# EAGLE design differential_output_board (EAGLE 9.2.1)
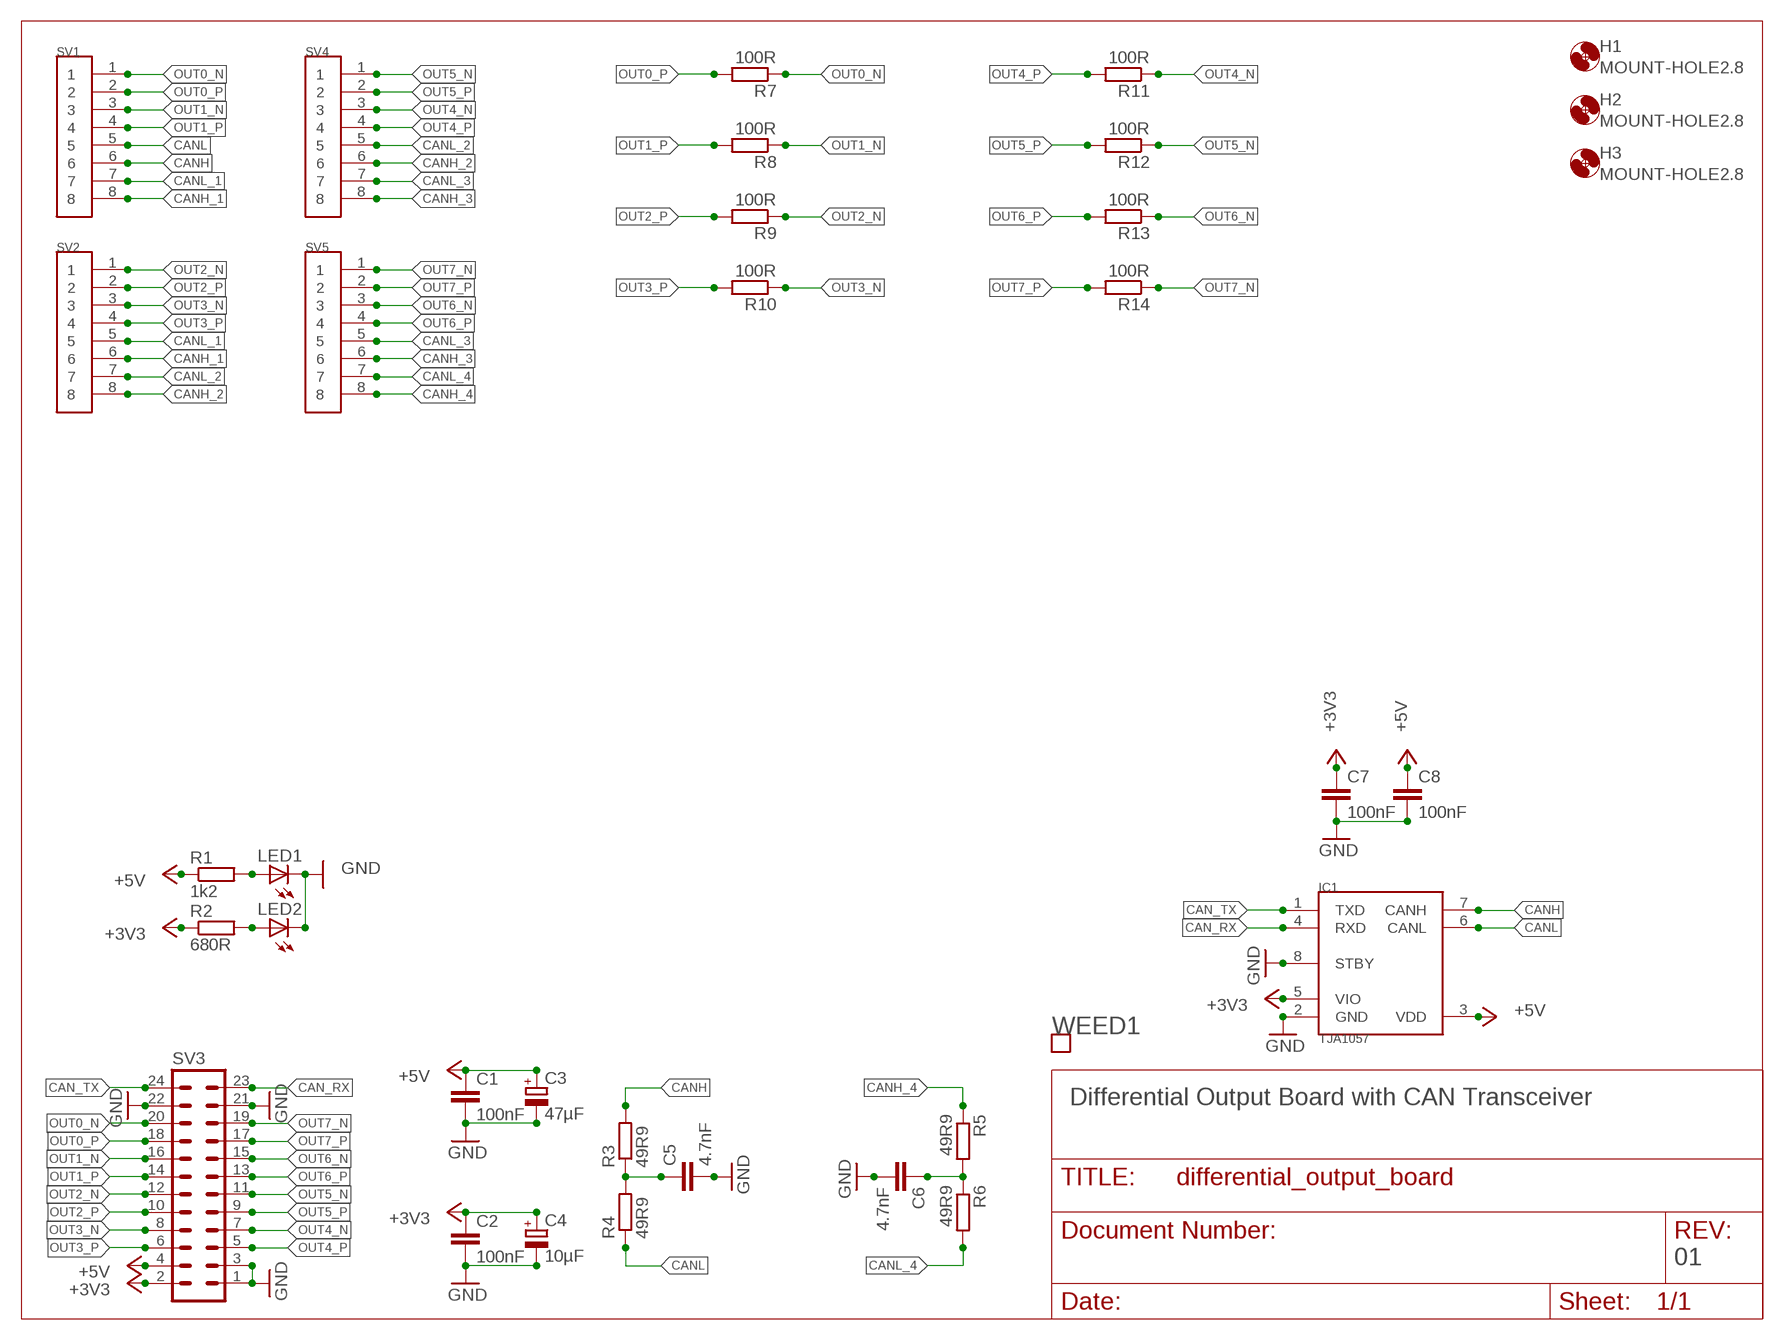
[diagram p0: schematic, sheet 1]

## Parts
C1  100nF  C-EUC0805  [C0805]
C2  100nF  C-EUC0805  [C0805]
C3  47µF  CPOL-EUSMCD  [SMC_D]
C4  10µF  CPOL-EUSMCB  [SMC_B]
C5  4.7nF  C-EUC0805  [C0805]
C6  4.7nF  C-EUC0805  [C0805]
C7  100nF  C-EUC0805  [C0805]
C8  100nF  C-EUC0805  [C0805]
H1  MOUNT-HOLE2.8  [2,8]
H2  MOUNT-HOLE2.8  [2,8]
H3  MOUNT-HOLE2.8  [2,8]
IC1  TJA1057  [SOIC8]
LED1  LEDCHIPLED_1206  [CHIPLED_1206]
LED2  LEDCHIPLED_1206  [CHIPLED_1206]
R1  1k2  R-EU_M0805  [M0805]
R2  680R  R-EU_M0805  [M0805]
R3  49R9  R-EU_M1206  [M1206]
R4  49R9  R-EU_M1206  [M1206]
R5  49R9  R-EU_M1206  [M1206]
R6  49R9  R-EU_M1206  [M1206]
R7  100R  R-EU_M1206  [M1206]
R8  100R  R-EU_M1206  [M1206]
R9  100R  R-EU_M1206  [M1206]
R10  100R  R-EU_M1206  [M1206]
R11  100R  R-EU_M1206  [M1206]
R12  100R  R-EU_M1206  [M1206]
R13  100R  R-EU_M1206  [M1206]
R14  100R  R-EU_M1206  [M1206]
SV1  SS-51000-003  [SS-51000-003]
SV2  SS-51000-003  [SS-51000-003]
SV3  MA12-2  [MA12-2]
SV4  SS-51000-003  [SS-51000-003]
SV5  SS-51000-003  [SS-51000-003]
WEED1  WEED  [DOINK]

## Nets
+3V3: C2.1 C4.+ C7.1 IC1.5(VIO) R2.1 SV3.2
+5V: C1.1 C3.+ C8.1 IC1.3(VDD) R1.1 SV3.4
CAN_RX: IC1.4(RXD) SV3.23
CAN_TX: IC1.1(TXD) SV3.24
CANH: IC1.7(CANH) R3.2 SV1.6
CANH_1: SV1.8 SV2.6
CANH_2: SV2.8 SV4.6
CANH_3: SV4.8 SV5.6
CANH_4: R5.1 SV5.8
CANL: IC1.6(CANL) R4.1 SV1.5
CANL_1: SV1.7 SV2.5
CANL_2: SV2.7 SV4.5
CANL_3: SV4.7 SV5.5
CANL_4: R6.2 SV5.7
GND: C1.2 C2.2 C3.- C4.- C5.2 C6.2 C7.2 C8.2 IC1.2(GND) IC1.8(STBY) LED1.C LED2.C SV3.1 SV3.3 SV3.21 SV3.22
N$1: C5.1 R3.1 R4.2
N$2: C6.1 R5.2 R6.1
N$13: LED1.A R1.2
N$14: LED2.A R2.2
OUT0_N: R7.1 SV1.1 SV3.20
OUT0_P: R7.2 SV1.2 SV3.18
OUT1_N: R8.1 SV1.3 SV3.16
OUT1_P: R8.2 SV1.4 SV3.14
OUT2_N: R9.1 SV2.1 SV3.12
OUT2_P: R9.2 SV2.2 SV3.10
OUT3_N: R10.1 SV2.3 SV3.8
OUT3_P: R10.2 SV2.4 SV3.6
OUT4_N: R11.1 SV3.7 SV4.3
OUT4_P: R11.2 SV3.5 SV4.4
OUT5_N: R12.1 SV3.11 SV4.1
OUT5_P: R12.2 SV3.9 SV4.2
OUT6_N: R13.1 SV3.15 SV5.3
OUT6_P: R13.2 SV3.13 SV5.4
OUT7_N: R14.1 SV3.19 SV5.1
OUT7_P: R14.2 SV3.17 SV5.2

## Notes on the sheet
- Differential Output Board with CAN Transceiver
- 01

## Library data of the parts
C1 C2 C7 C8 = rcl:C-EU: CAPACITOR, European symbol; MOUSER: 710-885012207072; SPICEPREFIX: C
C3 = rcl:CPOL-EU: POLARIZED CAPACITOR, European symbol; MOUSER: 581-TAJD476M016RNJV; SPICEPREFIX: C
C4 = rcl:CPOL-EU: POLARIZED CAPACITOR, European symbol; MOUSER: 581-TAJB106K020RNJV; SPICEPREFIX: C
C5 C6 = rcl:C-EU: CAPACITOR, European symbol; MOUSER: 710-885012207037; SPICEPREFIX: C
H1-H3 = holes:MOUNT-HOLE: MOUNTING HOLE with drill center marker
IC1 = lichtenstein_onion:TJA1057: TJA1057 – High-speed CAN transceiver Datasheet <https://www.nxp.com/docs/en/data-sheet/TJA1057.pdf>; MOUSER: 771-TJA1057GT/3J
LED1 LED2 = led:LED: LED OSRAM: - CHIPLED LG R971, LG N971, LY N971, LG Q971, LY Q971, LO R971, LY R971 LH N974, LH R974 LS Q976, LO Q976, LY Q976 LO Q996 - Hyper CHIPLED LW Q18S LB Q993, LB Q99A, LB R99A - SideLED LS A670, LO A670, LY A670, LG A670, LP A670 LB A673, LV A673, LT A673, LW A673 LH A674 LY A675 LS A676, LA A676, LO A676, LY A676, LW A676 LS A679, LY A679, LG A679 - Hyper Micro SIDELED® LS Y876, LA Y876, LO Y876, LY Y876 LT Y87S - SmartLED LW L88C, LW L88S LB L89C, LB L89S, LG L890 LS L89K, LO L89K, LY L89K LS L896, LA L896, LO L896, LY L896 - TOPLED LS T670, LO T670, LY T670, LG T670, LP T670 LSG T670, LSP T670, LSY T670, LOP T670, LYG T670 LG T671, LOG T671, LSG T671 LB T673, LV T673, LT T673, LW T673 LH T674 LS T676, LA T676, LO T676, LY T676, LB T676, LH T676, LSB T676, LW T676 LB T67C, LV T67C, LT T67C, LS T67K, LO T67K, LY T67K, LW E67C LS E67B, LA E67B, LO E67B, LY E67B, LB E67C, LV E67C, LT E67C LW T67C LS T679, LY T679, LG T679 LS T770, LO T770, LY T770, LG T770, LP T770 LB T773, LV T773, LT T773, LW T773 LH T774 LS E675, LA E675, LY E675, LS T675 LS T776, LA T776, LO T776, LY T776, LB T776 LHGB T686 LT T68C, LB T68C - Hyper Mini TOPLED® LB M676 - Mini TOPLED Santana® LG M470 LS M47K, LO M47K, LY M47K Source: http://www.osram.convergy.de LUXEON: - LUMILED® LXK2-PW12-R00, LXK2-PW12-S00, LXK2-PW14-U00, LXK2-PW14-V00 LXK2-PM12-R00, LXK2-PM12-S00, LXK2-PM14-U00 LXK2-PE12-Q00, LXK2-PE12-R00, LXK2-PE12-S00, LXK2-PE14-T00, LXK2-PE14-U00 LXK2-PB12-K00, LXK2-PB12-L00, LXK2-PB12-M00, LXK2-PB14-N00, LXK2-PB14-P00, LXK2-PB14-Q00 LXK2-PR12-L00, LXK2-PR12-M00, LXK2-PR14-Q00, LXK2-PR14-R00 LXK2-PD12-Q00, LXK2-PD12-R00, LXK2-PD12-S00 LXK2-PH12-R00, LXK2-PH12-S00 LXK2-PL12-P00, LXK2-PL12-Q00, LXK2-PL12-R00 Source: www.luxeon.com KINGBRIGHT: KA-3528ASYC Source: www.kingbright.com; MOUSER: 604-APTR3216SGC
R1 = rcl:R-EU_: RESISTOR, European symbol; MOUSER: 652-CR0805FX-1201ELF; SPICEPREFIX: R
R2 = rcl:R-EU_: RESISTOR, European symbol; MOUSER: 652-CR0805-FX6800GLF; SPICEPREFIX: R
R3-R6 = rcl:R-EU_: RESISTOR, European symbol; MOUSER: 71-CRCW120649R9FKEAC; SPICEPREFIX: R
R7-R14 = rcl:R-EU_: RESISTOR, European symbol; MOUSER: 652-CR1206FX-1000ELF; SPICEPREFIX: R
SV1 SV2 SV4 SV5 = lichtenstein_onion:SS-51000-003: SS-51000-003 – Unshielded, CAT6a, Punch Down Block, 8P 8C Information <https://belfuse.com/product/part-details?partn=SS-51000-003> Mechanical Drawing <https://belfuse.com/resources/drawings/stewartconnector/dr-stw-ss-51000-003.pdf> Compatible with SS-51000-004 (same connector but with color coded terminals for CAT6 cable); MOUSER: 530-SS-51000-003
SV3 = con-lstb:MA12-2: PIN HEADER; MOUSER: 517-30320-6002; OC_FARNELL: unknown; OC_NEWARK: unknown
WEED1 = lichtenstein_onion:WEED

## Board
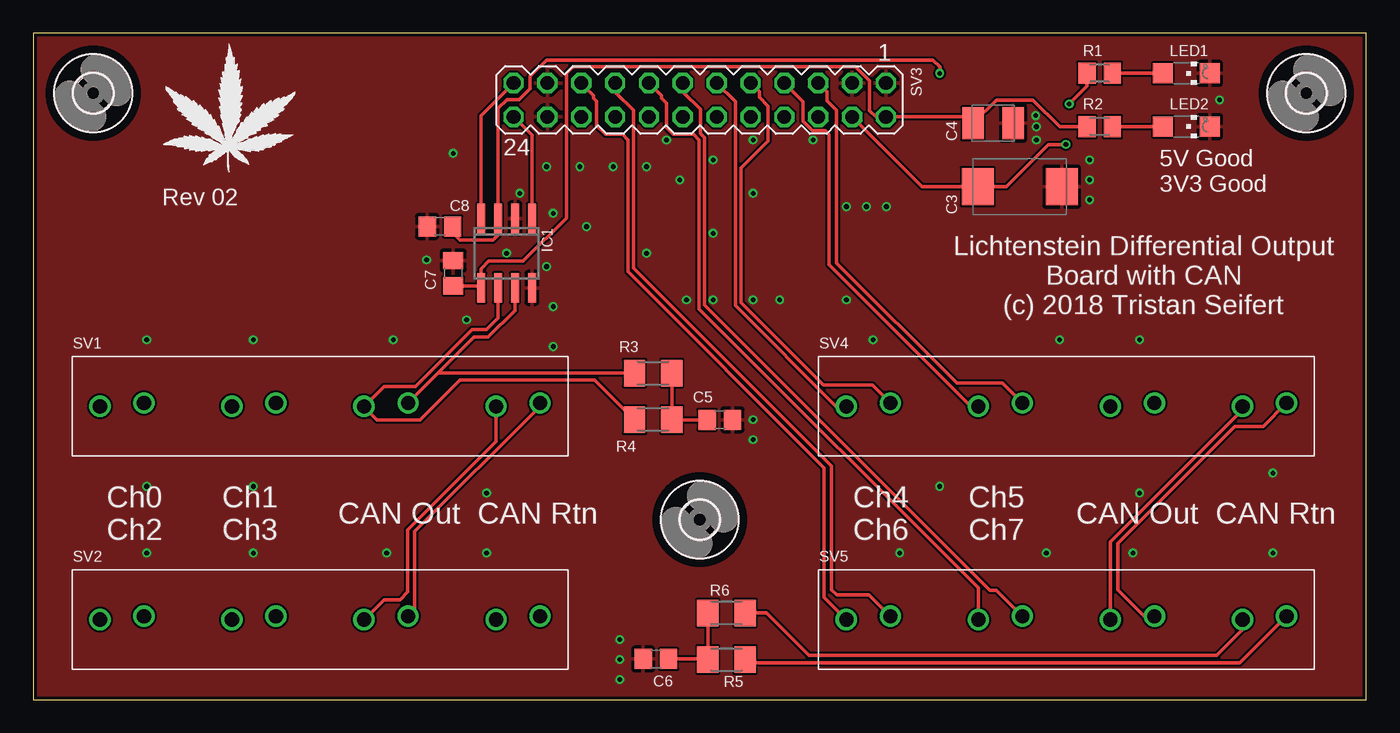
[diagram p1: board, top side]
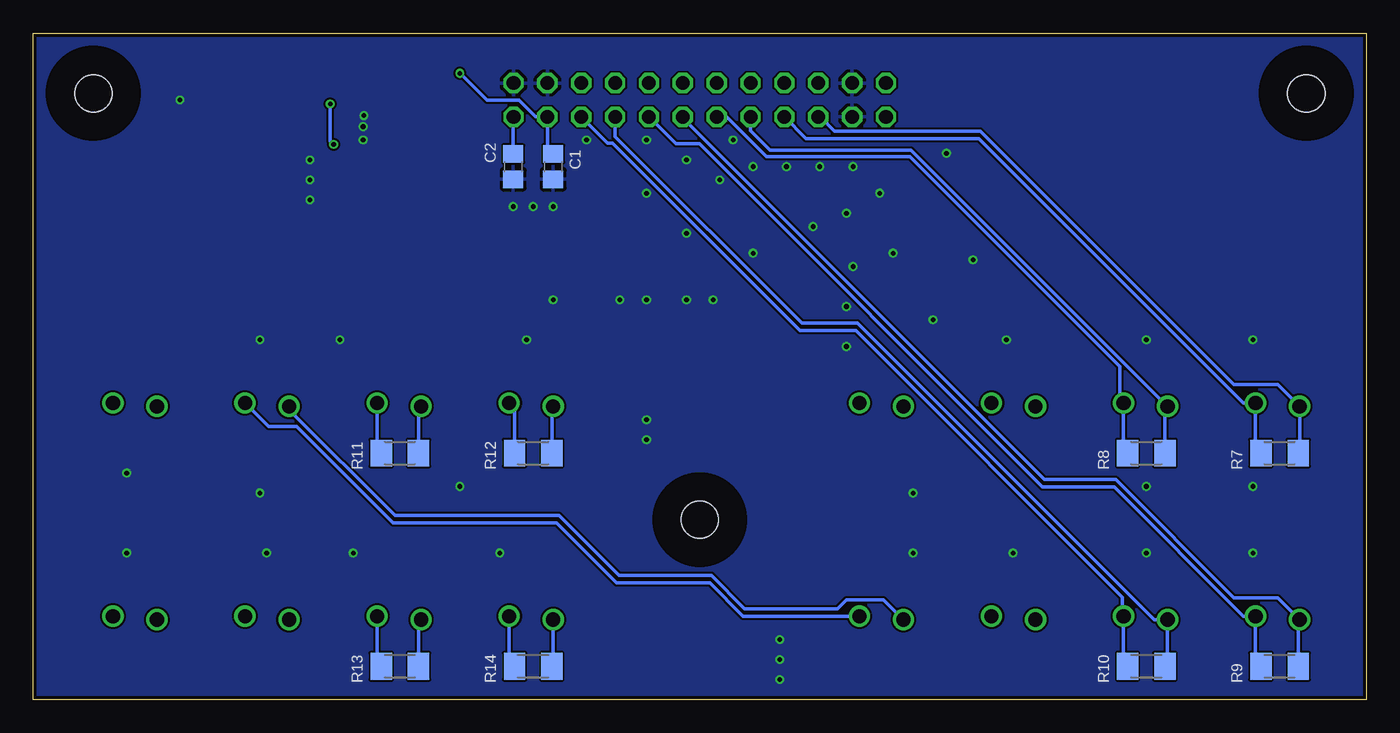
[diagram p2: board, bottom side, seen from below]

Size 100 x 50 mm. Coordinates in mm from the lower left corner, seen from the top.
Outline: 0,0 100,0 100,50 0,50 0,0
Copper layers (1*16): Top 0.035mm / dielectric 1.5mm / Bottom 0.035mm
Design rules "dirt_cheap_dirty_boards.v1.1": minimum track width 6mil, minimum drill 12mil, track to track 6mil, track to pad 6mil, pad to pad 6mil, via to via 6mil, smd to smd 0mil, copper to edge 10mil, drill to drill 10mil, minimum pad ring 10mil, minimum via ring 6mil, stop-mask expansion 2mil, vias tented up to drill 25mil, thermal gap 10mil

### Footprints (pad centres in the part's own frame; a part is rotated, then mirrored left to right if it is on the bottom)
C0805 = smd 1.3 x 1.5: 1 -0.95,0; 2 0.95,0
SMC_D = smd 2.4 x 2.8: + -3.15,0; - 3.15,0
SMC_B = smd 1.6 x 2.4: + -1.5,0; - 1.5,0
2,8 = hole 2.8: 0,0
SOIC8 = smd 0.6 x 2.2: 1 -1.905,-2.6; 2 -0.635,-2.6; 3 0.635,-2.6; 4 1.905,-2.6; 5 1.905,2.6; 6 0.635,2.6; 7 -0.635,2.6; 8 -1.905,2.6
CHIPLED_1206 = smd 1.5 x 1.5: A 0,-1.75; C 0,1.75
M0805 = smd 1.3 x 1.6: 1 -0.95,0; 2 0.95,0
M1206 = smd 1.6 x 2: 1 -1.4,0; 2 1.4,0
SS-51000-003 = drill 1.067: 1 0,0; 2 3.302,0.254; 3 9.906,0; 4 13.208,0.254; 5 19.812,0; 6 23.114,0.254; 7 29.718,0; 8 33.02,0.254
MA12-2 = drill 1.016 octagon: 1 -13.97,-1.27; 2 -13.97,1.27; 3 -11.43,-1.27; 4 -11.43,1.27; 5 -8.89,-1.27; 6 -8.89,1.27; 7 -6.35,-1.27; 8 -6.35,1.27; 9 -3.81,-1.27; 10 -3.81,1.27; 11 -1.27,-1.27; 12 -1.27,1.27; 13 1.27,-1.27; 14 1.27,1.27; 15 3.81,-1.27; 16 3.81,1.27; 17 6.35,-1.27; 18 6.35,1.27; 19 8.89,-1.27; 20 8.89,1.27; 21 11.43,-1.27; 22 11.43,1.27; 23 13.97,-1.27; 24 13.97,1.27

### Placement (x,y rotation side)
C1  61,40 270 bottom
C2  64,40 270 bottom
C3  74,38.49 0 top
C4  72,43.25 0 top
C5  51.5,21 0 top
C6  46.71,3.04 180 top
C7  31.5,32 90 top
C8  30.5,35.5 180 top
H1  4.5,45.5 0 top
H2  95.5,45.5 0 top
H3  50,13.5 0 top
IC1  35.5,33.5 180 top
LED1  86.5,47 270 top
LED2  86.5,43 270 top
R1  80,47 0 top
R2  80,43 0 top
R3  46.5,24.5 180 top
R4  46.5,21 0 top
R5  52,3 180 top
R6  52,6.5 0 top
R7  6.5,18.5 180 bottom
R8  16.5,18.5 180 bottom
R9  6.5,2.5 180 bottom
R10  16.5,2.5 180 bottom
R11  72.5,18.5 180 bottom
R12  62.5,18.5 180 bottom
R13  72.5,2.5 180 bottom
R14  62.5,2.5 180 bottom
SV1  5,22 0 top
SV2  5,6 0 top
SV3  50,45 180 top
SV4  61,22 0 top
SV5  61,6 0 top
WEED1  9.73,39.5 0 top

### Tracks (layer width: path | path; a pad name or v marks a point on that pad's centre or on a via)
+3V3
  Top 0.254: R2.1 77,43 75,45 72.25,45 C4.+ 70.02,43.73 SV3.2 63.2,43.73 62.74,44.2 62.74,46.44 61.67,47.5 40.5,47.5 40,47 40,36.14 36.75,32.89 34.16,32.89 33.59,32.33 IC1.5 33.45,31.05 C7.1
  Bottom 0.254: C2.1 64,43.73 SV3.2
+5V  (via drill 0.35)
  Top 0.254: SV3.4 66.67,38.49 C3.+ 72.99,38.49 76.16,41.66 v77.47,41.66 | v68,47 68,47.5 67.5,48 38.5,48 37.27,46.77 37.27,45.86 36.44,45.02 35.52,45.02 34.87,44.37 IC1.3 34.87,34.87 34.5,34.5 32,34.5 31.45,35.05 C8.1 | R1.1 79.05,46.03 v77.72,44.7
  Bottom 0.254: C1.1 61.43,41.38 SV3.4 62.31,43.73 63.56,44.98 65.97,44.98 v68,47 | v77.72,44.7 77.72,41.91 v77.47,41.66
CAN_RX
  Top 0.254: SV3.23 33.59,43.84 IC1.4
CAN_TX
  Top 0.254: IC1.1 37.41,42.35 SV3.24
CANH
  Top 0.254: SV1.6 28.68,22.82 | 28.68,22.82 33.05,27.2 34.13,27.2 36.13,29.2 IC1.7 | R3.2 30.36,24.5 28.68,22.82
CANH_1
  Top 0.254: SV1.8 38.02,22 28.62,12.6 28.62,6.76 SV2.6
CANH_2
  Bottom 0.254: SV2.8 46.75,6.25 49.25,8.75 56.25,8.75 60.75,13.25 73,13.25 80.25,20.5 82.36,20.5 SV4.6
CANH_3
  Top 0.254: SV4.8 92.27,20.5 90.16,20.5 81.37,11.71 81.37,8.25 83.36,6.25 SV5.6
CANH_4
  Top 0.254: R5.1 53.65,2.75 90.51,2.75 SV5.8
CANL
  Top 0.254: IC1.6 34.87,28.62 34,27.75 32.93,27.75 28.68,23.5 26.31,23.5 SV1.5 25.81,21 29,21 32,24 42.1,24 R4.1
CANL_1
  Top 0.254: SV2.5 26.31,7.5 27.5,7.5 28.06,8.06 28.06,12.73 34.72,19.38 SV1.7
CANL_2
  Bottom 0.254: SV2.7 36.22,7.5 39,7.5 39.69,6.81 46.63,6.81 49.12,9.3 56.05,9.3 60.55,13.8 72.87,13.8 80.81,21.75 SV4.5
CANL_3
  Top 0.254: SV4.7 90.72,21.75 80.81,11.84 SV5.5
CANL_4
  Top 0.254: SV5.7 90.72,5.22 88.81,3.31 58.2,3.31 55,6.5 R6.2
GND  (via drill 0.35)
  other vias: 89,45 64,37 61,37 35.5,33.5 36.5,38 44,3 32.5,28.5 39,26.5 54,21 75.25,43 79.25,39 29.5,33 31.5,41 38.5,40 39,36.5 41,40 43.5,40 38.5,32.5 39,29.5 46,33.5 48.5,39 47.5,42 46,40 41.5,35.5 51,40.5 54,42 54,38 51,35 51,30 49,30 54,30 56,30 61,30 58.5,42 62.5,37 68,16 93,17 65,11 76,11 82.5,11 93,11 34,11 26.5,11 16.5,11 8.5,11 8.5,16 16.5,16 34,15.5 8.5,27 16.5,27 27,27 83,27 77,27 63,27 83,15.5 44,4.5 44,1.5 54,19.5 79.25,40.5 79.25,37.5 75.25,42 75.19,43.83
  pour Bottom: 0,0 0,50 100,50 100,0
  pour Top: 0,0 0,50 100,50 100,0
N$1
  Top 0.254: R3.1 R4.2 C5.1
N$2
  Top 0.254: C6.1 50.56,3.04 R5.2 R6.1
N$13
  Top 0.254: LED1.A R1.2
N$14
  Top 0.254: LED2.A R2.2
OUT0_N
  Bottom 0.254: SV3.20 40.96,43.73 39.89,42.66 28.94,42.66 9.92,23.64 6.64,23.64 SV1.1 5,18.6 R7.1
OUT0_P
  Bottom 0.254: SV3.18 42.02,42.1 29.07,42.1 9.22,22.25 SV1.2 8.3,18.9 R7.2
OUT1_N
  Bottom 0.254: SV3.16 46.19,42.69 44.75,41.25 34.15,41.25 SV1.3 15.1,21.81 R8.1
OUT1_P
  Bottom 0.254: SV3.14 47.98,43.73 45,40.75 34.25,40.75 18.5,25 18.5,22.55 SV1.4 18.21,18.81 R8.2
OUT2_N
  Bottom 0.254: SV3.12 51.27,43.62 24.15,16.5 18.78,16.5 9.92,7.64 6.64,7.64 SV2.1 5.1,5.9 R9.1
OUT2_P
  Bottom 0.254: SV3.10 51.78,41.7 50.03,41.7 24.28,15.94 18.91,15.94 9.22,6.25 SV2.2 8.3,2.9 R9.2
OUT3_N
  Bottom 0.254: SV3.8 56.35,42.25 42.35,28.24 38.15,28.24 15.91,6 SV2.3 14.91,2.69 R10.1
OUT3_P
  Bottom 0.254: SV3.6 56.92,41.76 56.55,41.76 42.47,27.68 38.28,27.68 18.28,7.68 18.28,6.32 SV2.4 18.21,2.81 R10.2
OUT4_N
  Top 0.254: SV4.3 70.34,22 59.7,32.64 59.7,42.41 59.42,42.69 58.46,42.69 57.75,43.4 57.75,44.87 SV3.7
  Bottom 0.254: R11.1 71.1,21.81 SV4.3
OUT4_P
  Top 0.254: SV4.4 72.72,23.75 69.28,23.75 60.26,32.77 60.26,44.23 59.55,44.95 59.55,45.62 SV3.5
  Bottom 0.254: R11.2 74.21,18.81 SV4.4
OUT5_N
  Top 0.254: SV4.1 60.23,22 52.67,29.57 52.67,44.87 SV3.11
  Bottom 0.254: R12.1 61.1,21.9 SV4.1
OUT5_P
  Top 0.254: SV4.2 62.96,23.59 59.29,23.59 53.09,29.8 53.09,39.88 55.12,41.91 55.12,44.55 54.47,45.2 54.47,45.62 SV3.9
  Bottom 0.254: R12.2 63.9,21.85 SV4.2
OUT6_N
  Top 0.254: SV5.3 70.91,8.36 49.95,29.32 49.95,42 49.53,42.42 48.01,42.42 47.5,42.93 47.5,44.74 47.13,45.12 47.13,45.33 SV3.15
  Bottom 0.254: SV5.3 71.1,5.81 R13.1
OUT6_P
  Top 0.254: SV5.4 72.27,8.2 71.76,8.2 50.36,29.6 50.36,42.17 50.04,42.48 50.04,44.29 48.73,45.6 SV3.13
  Bottom 0.254: R13.2 74.21,2.81 SV5.4
OUT7_N
  Top 0.254: SV5.1 59.34,7.66 59.34,17.39 44.62,32.11 44.62,42 44.2,42.42 42.93,42.42 42.27,43.08 42.27,44.9 42.05,45.12 42.05,45.33 SV3.19
  Bottom 0.254: SV5.1 61,2.6 R14.1
OUT7_P
  Top 0.254: SV5.2 62.7,7.86 60.28,7.86 59.9,8.24 59.9,17.52 45.02,32.39 45.02,44.23 43.65,45.6 SV3.17
  Bottom 0.254: SV5.2 64.3,2.9 R14.2

### Text on the board
tNames: 5V Good / 3V3 Good | Rev 02 | Lichtenstein Differential Output / Board with CAN / (c) 2018 Tristan Seifert | Ch0 Ch1 / Ch2 Ch3 | CAN Out CAN Rtn | Ch4 Ch5 / Ch6 Ch7 | CAN Out CAN Rtn